# Altium schematic sheet ModulationAnalog.SchDoc
size A3; SheetNumber: 3; SheetTotal: 4
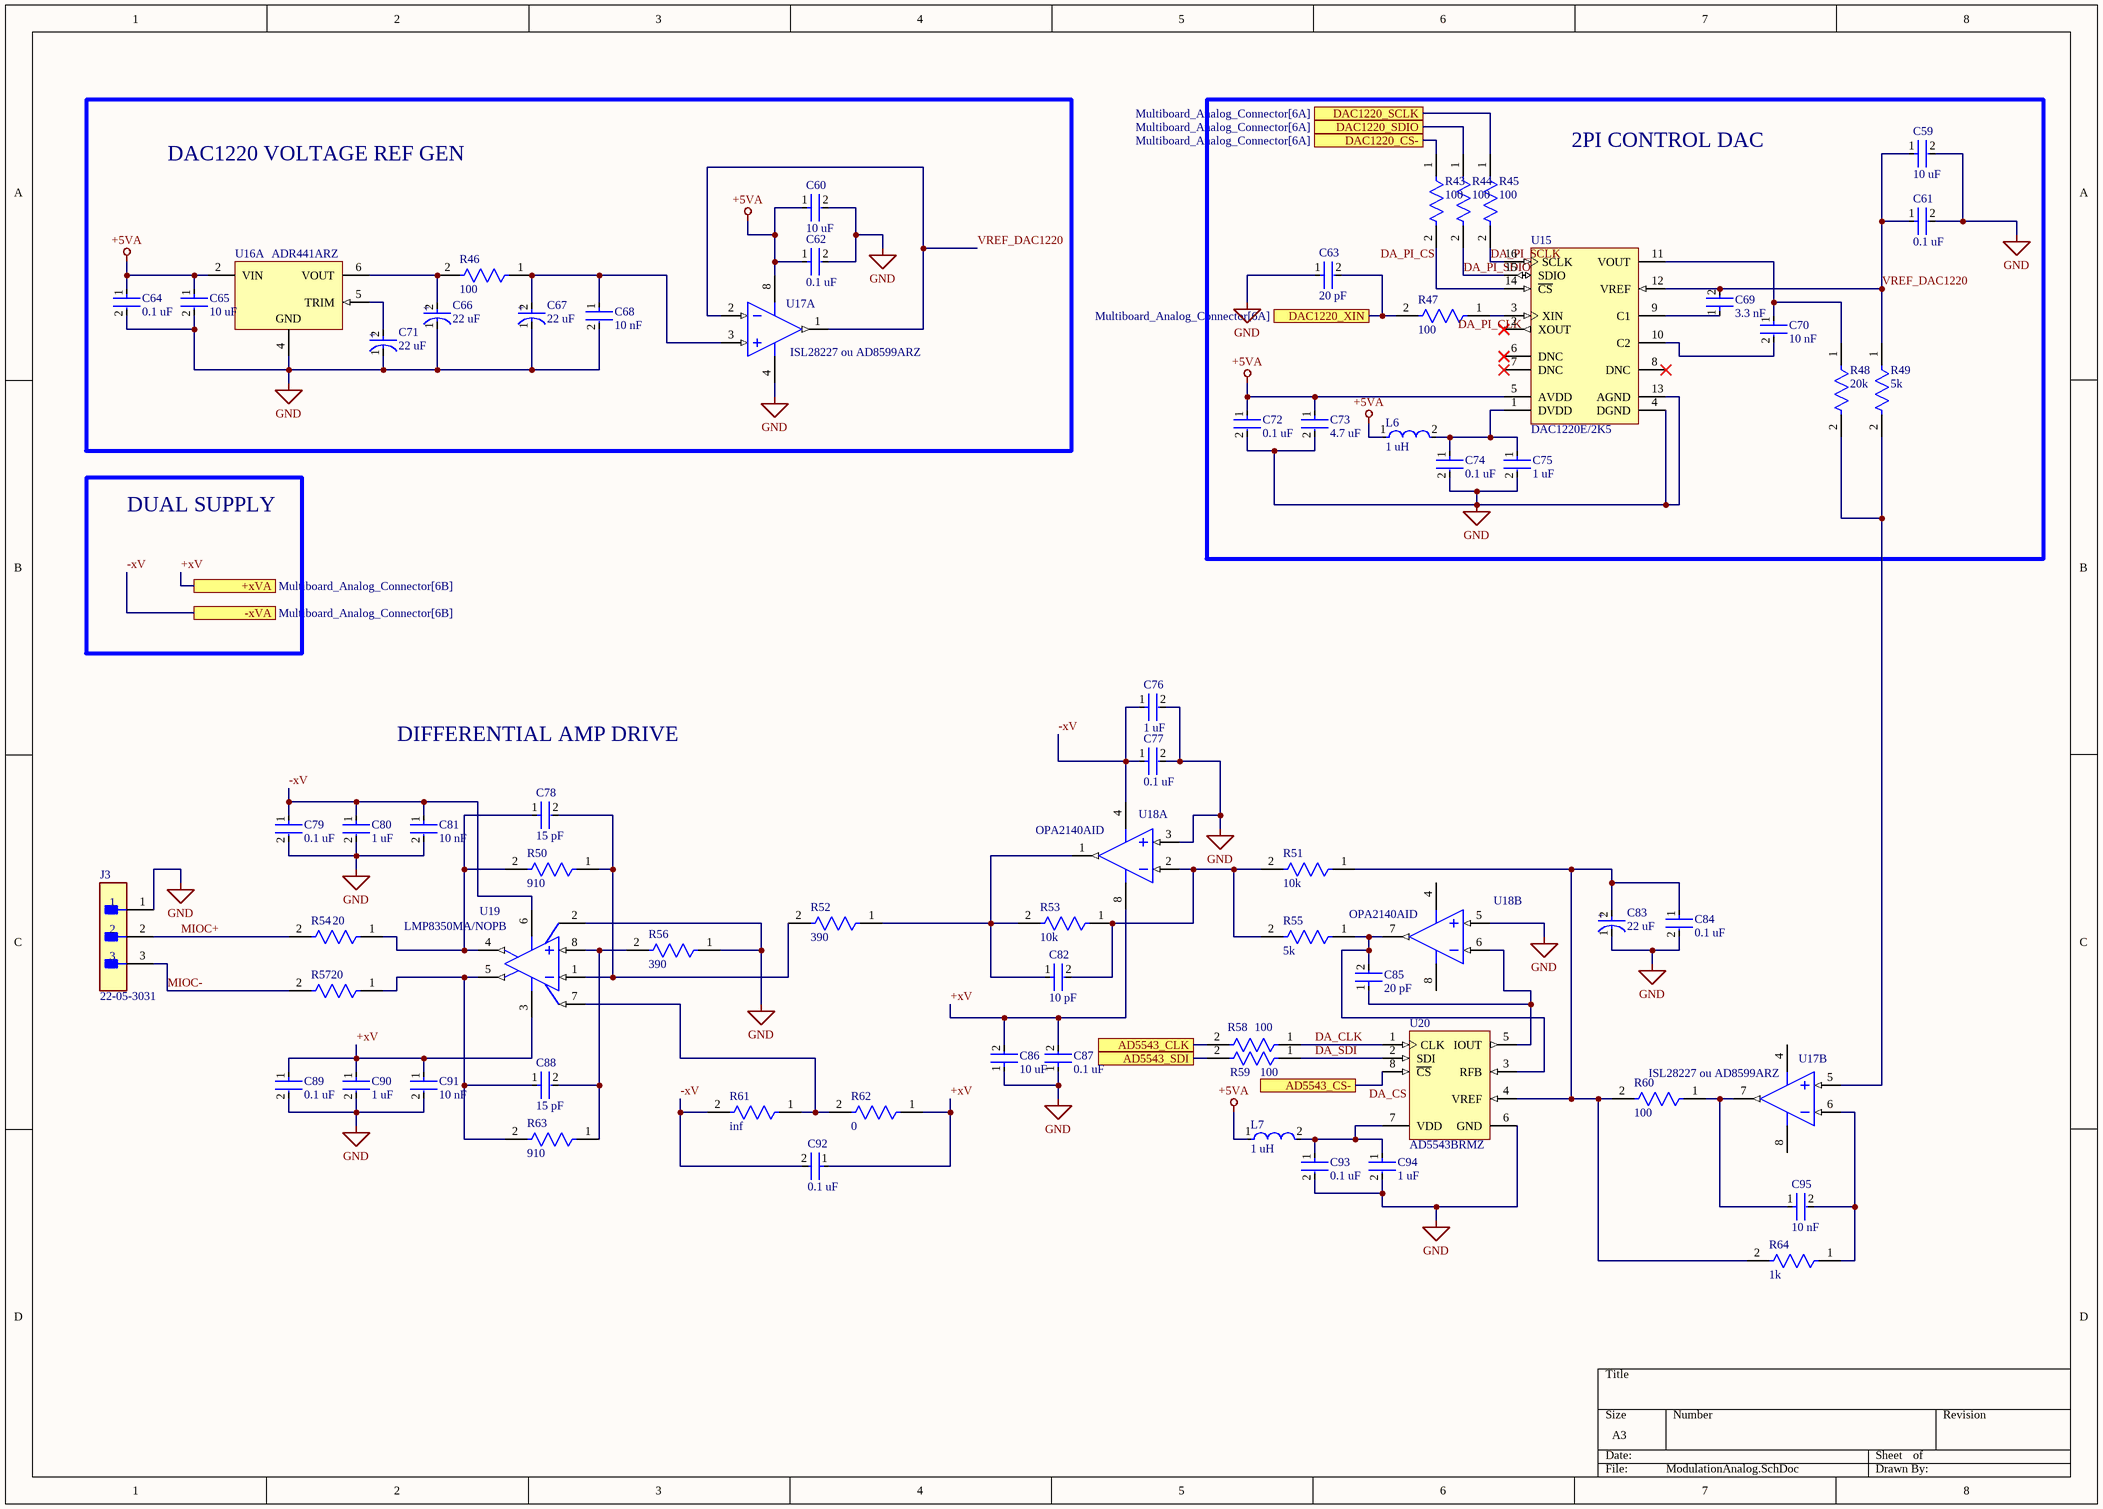
[diagram p0: ModulationAnalog.SchDoc]

## Parts
C59  10 uF  [FP-CC0805-0_85-MFG]
C60  10 uF  [FP-CC0805-0_85-MFG]
C61  0.1 uF  [FP-CC0805-0_85-MFG]
C62  0.1 uF  [FP-CC0805-0_85-MFG]
C63  20 pF  [FP-CC0805-0_85-MFG]
C64  0.1 uF  [FP-CC0805-0_85-MFG]
C65  10 uF  [FP-CC0805-0_85-MFG]
C66  22 uF  [FP-TAJP-MFG]
C67  22 uF  [FP-TAJP-MFG]
C68  10 nF  [FP-CC0805-0_85-MFG]
C69  3.3 nF  [FP-CC0805-0_85-MFG]
C70  10 nF  [FP-CC0805-0_85-MFG]
C71  22 uF  [FP-TAJP-MFG]
C72  0.1 uF  [FP-CC0805-0_85-MFG]
C73  4.7 uF  [FP-CC0805-0_85-MFG]
C74  0.1 uF  [FP-CC0805-0_85-MFG]
C75  1 uF  [FP-CC0805-0_85-MFG]
C76  1 uF  [FP-CC0805-0_85-MFG]
C77  0.1 uF  [FP-CC0805-0_85-MFG]
C78  15 pF  [FP-CC0805-0_85-MFG]
C79  0.1 uF  [FP-CC0805-0_85-MFG]
C80  1 uF  [FP-CC0805-0_85-MFG]
C81  10 nF  [FP-CC0805-0_85-MFG]
C82  10 pF  [FP-CC0805-0_85-MFG]
C83  22 uF  [FP-TAJP-MFG]
C84  0.1 uF  [FP-CC0805-0_85-MFG]
C85  20 pF  [FP-CC0805-0_85-MFG]
C86  10 uF  [FP-CC0805-0_85-MFG]
C87  0.1 uF  [FP-CC0805-0_85-MFG]
C88  15 pF  [FP-CC0805-0_85-MFG]
C89  0.1 uF  [FP-CC0805-0_85-MFG]
C90  1 uF  [FP-CC0805-0_85-MFG]
C91  10 nF  [FP-CC0805-0_85-MFG]
C92  0.1 uF  [FP-CC0805-0_85-MFG]
C93  0.1 uF  [FP-CC0805-0_85-MFG]
C94  1 uF  [FP-CC0805-0_85-MFG]
C95  10 nF  [FP-CC0805-0_85-MFG]
J3  22-05-3031  [FP-22-05-3031-MFG]
L6  1 uH  [FP-LQM21DN_00-IPC_B]
L7  1 uH  [FP-LQM21DN_00-IPC_B]
R43  100  [FP-RR1220-MFG]
R44  100  [FP-RR1220-MFG]
R45  100  [FP-RR1220-MFG]
R46  100  [FP-RR1220-MFG]
R47  100  [FP-RR1220-MFG]
R48  20k  [FP-RR1220-MFG]
R49  5k  [FP-RR1220-MFG]
R50  910  [FP-RR1220-MFG]
R51  10k  [FP-RR1220-MFG]
R52  390  [FP-RR1220-MFG]
R53  10k  [FP-RR1220-MFG]
R54  20  [FP-RR1220-MFG]
R55  5k  [FP-RR1220-MFG]
R56  390  [FP-RR1220-MFG]
R57  20  [FP-RR1220-MFG]
R58  100  [FP-RR1220-MFG]
R59  100  [FP-RR1220-MFG]
R60  100  [FP-RR1220-MFG]
R61  inf  [FP-RR1220-MFG]
R62  0  [FP-RR1220-MFG]
R63  910  [FP-RR1220-MFG]
R64  1k  [FP-RR1220-MFG]
U15  DAC1220E/2K5  [TI-DBQ16_N]
U16  ADR441ARZ  [ADI-R-8_L]  (part A of 2)
U17  ISL28227 ou AD8599ARZ  [ADI-R-8_M]  (parts A,B of 2)
U18  OPA2140AID  [D0008A_N]  (parts A,B of 2)
U19  LMP8350MA/NOPB  [D0008A_L]
U20  AD5543BRMZ  [RM-8_N]

## Blocks framed on the sheet
DAC1220 VOLTAGE REF GEN: C60 C62 C64-C68 C71 R46 U16 U17
2PI CONTROL DAC: C59 C61 C63 C69 C70 C72-C75 L6 R43-R45 R47-R49 U15

## Ports
+xVA (see Multiboard_Analog_Connector[6B]), -xVA (see Multiboard_Analog_Connector[6B]), AD5543_CLK (see Multiboard_Analog_Connector[7A]), AD5543_CS- (see Multiboard_Analog_Connector[7A]), AD5543_SDI (see Multiboard_Analog_Connector[7A]), DAC1220_CS- (see Multiboard_Analog_Connector[6A]), DAC1220_SCLK (see Multiboard_Analog_Connector[6A]), DAC1220_SDIO (see Multiboard_Analog_Connector[6A]), DAC1220_XIN (see Multiboard_Analog_Connector[6A])

## Nets
+5VA: C60.1 C62.1 C64.1 C65.1 C72.1 C73.1 L6.1 L7.1 U15.5(AVDD) U16.2(VIN) U17.8(+V)
GND: C59.2 C60.2 C61.2 C62.2 C63.1 C64.2 C65.2 C66.1(C) C67.1(C) C68.2 C71.1(C) C72.2 C73.2 C74.2 C75.2 C76.2 C77.2 C79.2 C80.2 C81.2 C83.1(C) C84.2 C86.1 C87.1 C89.2 C90.2 C91.2 C93.2 C94.2 J3.1 R56.1 U15.4(DGND) U15.13(AGND) U16.4(GND) U17.4(-V) U18.3(IN_A+) U18.5(IN_B+) U19.2(VOCM) U20.6(GND)
+xV: C86.2 C87.2 C89.1 C90.1 C91.1 C92.1 R62.1 U18.8(V+) U19.3(V+) ; port +xVA
-xV: C76.1 C77.1 C79.1 C80.1 C81.1 C92.2 R61.2 U18.4(V-) U19.6(V-) ; port -xVA
AD5543_CLK: R58.2 ; port AD5543_CLK
AD5543_SDI: R59.2 ; port AD5543_SDI
DA_CLK: R58.1 U20.1(CLK)
DA_CS: U20.8(~{CS}) ; port AD5543_CS-
DA_PI_CLK: R47.1 U15.3(XIN)
DA_PI_CS: R43.2 U15.14(~{CS})
DA_PI_SCLK: R45.2 U15.16(SCLK)
DA_PI_SDIO: R44.2 U15.15(SDIO)
DA_SDI: R59.1 U20.2(SDI)
DAC1220_CS-: R43.1 ; port DAC1220_CS-
DAC1220_SCLK: R45.1 ; port DAC1220_SCLK
DAC1220_SDIO: R44.1 ; port DAC1220_SDIO
DAC1220_XIN: C63.2 R47.2 ; port DAC1220_XIN
MIOC+: J3.2 R54.2
MIOC-: J3.3 R57.2
VREF_DAC1220: C59.1 C61.1 C69.2 R49.1 U15.12(VREF) U17.1(OUT_A) U17.2(-IN_A)
NetC66_2: C66.2(A) R46.2 U16.6(VOUT)
NetC67_2: C67.2(A) C68.1 R46.1 U17.3(+IN_A)
NetC69_1: C69.1 U15.9(C1)
NetC70_1: C70.1 R48.1 U15.11(VOUT)
NetC70_2: C70.2 U15.10(C2)
NetC71_2: C71.2(A) U16.5(TRIM)
NetC74_1: C74.1 C75.1 L6.2 U15.1(DVDD)
NetC78_1: C78.1 R50.2 R54.1 U19.4(OUT+)
NetC78_2: C78.2 R50.1 R52.2 U19.1(IN-)
NetC82_1: C82.1 R52.1 R53.2 U18.1(OUT_A)
NetC82_2: C82.2 R51.2 R53.1 R55.2 U18.2(IN_A-)
NetC83_2: C83.2(A) C84.1 R51.1 R60.2 R64.2 U20.4(VREF)
NetC85_1: C85.1 U18.6(IN_B-) U20.5(IOUT)
NetC85_2: C85.2 R55.1 U18.7(OUT_B) U20.3(RFB)
NetC88_1: C88.1 R57.1 R63.2 U19.5(OUT-)
NetC88_2: C88.2 R56.2 R63.1 U19.8(IN+)
NetC93_1: C93.1 C94.1 L7.2 U20.7(VDD)
NetC95_1: C95.1 R60.1 U17.7(OUT_B)
NetC95_2: C95.2 R64.1 U17.6(-IN_B)
NetR48_2: R48.2 R49.2 U17.5(+IN_B)
NetR61_1: R61.1 R62.2 U19.7(EN)

Not connected (* = marked no-connect by the designer): U15 2(XOUT)* 6(DNC)* 7(DNC)* 8(DNC)*

## Notes on the sheet
- DUAL SUPPLY
- DIFFERENTIAL AMP DRIVE
- (in symbol CMP-2007-04028-2) +

## Library data of the parts
C59-C65 C68-C70 C72-C82 C84-C95 = CMP-1036-04410-2: CAP CER 0.1UF 25V X7R 0805; Manufacturer Part Number: CC0805KRX7R8BB104; Manufacturer: Yageo; Tolerance: 0.1; Material: Ceramic; Value: 100 nF; ComponentLink2URL: http://www.yageo.com/documents/recent/UPY-GPHC_Y5V_6.3V-to-50V_8.pdf; Category: Cap; Mouser Description: Multilayer Ceramic Capacitors MLCC - SMD/SMT 100nF 25V X7R 10%; Device Class L1: Passive Components; Footprint Url: http://www.yageo.com/exep/pages/download/literatures/UPY-C_GEN_24.pdf; Height: 0.95mm; Digikey Description: CAP CER 0.1UF 25V X7R 0805; Lead Free: Yes; Temperature Range High: +85°C; Temperature: -30°C to +85°C; Ipc Land Pattern Name: CAPC200125X85; Capacitance: 100 nF; Automotive: No; Octopart: https://octopart.com/cc0805krx7r8bb104-yageo-39467766; Device Class L2: Capacitors; Temperature Characteristic: X7R; Voltage Rating: 25 V; ComponentLink2Description: Datasheet; Temperature Range Low: -30°C; Device Class L3: Ceramic Capacitors; RoHS: TRUE; Package: CC0805-0.85
C66 C67 C71 C83 = CMP-2007-04028-2: 10uF 10V  ±20% 6Ω 0805  SMD Tantalum Capacitor; Dissipation Factor: 8%; ESR (Equivalent Series Resistance): 6R; Polarity: Polar; Leakage Current: 1uA; Height: 1.5mm; Packaging: Tape and Reel; Max Operating Temperature: 125°C; Lead Free: Lead Free; Length: 2.05mm; RoHS Compliant: Yes; Number of Pins: 2; Case Code (Metric): 2012; Series: TAJ; Height - Seated (Max): 0.059inch; Mount: Surface Mount; REACH SVHC: No SVHC; Depth: 1.35mm; Tolerance: 20%; Case Code (Imperial): 0805; Dielectric Material: Tantalum; Features: General Purpose; Voltage: 10V; Capacitance: 10uF; Package Quantity: 1; Case/Package: 0805; Voltage Rating (DC): 10V; Termination: SMD/SMT; Width: 0.053inch; Min Operating Temperature: -55°C; Voltage Rating: 10V
J3 = CMP-04776-000253-1: CONN HEADER R/A 3POS 2.54MM; Number of Positions: 3; Max Current Rating: 4A; Contact Resistance: 10mR; Voltage Rating (DC): 250V; Gender: Male; Approvals: UL; Insulation Resistance: 50GR; Glow Wire Compliant: Non-compliant; Contact Plating: Tin; Packaging: Bulk; Color: White; Series: 7478; Package Quantity: 2000; Depth: 12.83mm; Mount: Through Hole; Length: 7.62mm; Fastening Type: Friction; Number of Circuits: 3; Lead Pitch: 2.54mm; Housing Color: White; Contact Type: Male Pin; Lead Free: Lead Free; Flammability Rating: UL94 V-0; Halogen Free: Low Halogen; Termination: Solder; Contact Mating Length: 0.264inch; Radiation Hardening: No; Min Operating Temperature: 0°C; Pitch: 2.54mm; RoHS Compliant: Yes; Orientation: Right Angle; Number of Rows: 1; Height: 6.35mm; Max Operating Temperature: 75°C; Voltage Rating: 250V; Contact Material: Brass; Number of Contacts: 3; Housing Material: Nylon; Current Rating: 4A
L6 L7 = CMP-06042-012978-1: Multilayer Type Inductor for General Circuits, 0805 (2012), 1μH, 10%, 0.4Ω, 50mA; Q Factor: 45; Test Frequency: 10MHz; DC Resistance (DCR): 400mR; Core Material: Ferrite; Shielding: Shielded; Inductance: 1uH; Self Resonant Frequency: 107MHz; Mount: Surface Mount; Depth: 1.45mm; Current Rating: 50mA; Lead Free: Lead Free; Height - Seated (Max): 0.041inch; Inductance Tolerance: 10%; Min Operating Temperature: -40°C; Height: 0.85mm; Radiation Hardening: No; Width: 1.25mm; Length: 2mm; Case Code (Imperial): 0805; Termination: SMD/SMT; Package Quantity: 1; Max Operating Temperature: 85°C; Case Code (Metric): 2012; Case/Package: 0805; Max DC Current: 50mA; DC Current: 50mA; Military Standard: Not; REACH SVHC: No SVHC; Packaging: Tape and Reel; Tolerance: 10%
R43-R64 = CMP-2001-03560-2: 49.9Ω ±0.5% 0.1W 1/10W Chip Resistor 0805 (2012 Metric) Thin Film; Voltage Rating: 100V; Temperature Coefficient: 50ppm/°C; Max Power Dissipation: 100mW; Resistance: 49.9R; Packaging: Tape and Reel; Length: 0.079inch; Termination: SMD/SMT; Case Code (Metric): 2012; Voltage Rating (DC): 100V; Height: 0.02inch; Width: 0.049inch; RoHS Compliant: Yes; Tolerance: 0.5%; Case/Package: 0805; Resistance Tolerance: 0.5%; Lead Free: Lead Free; Size Code: 0805; Min Operating Temperature: -55°C; Max Operating Temperature: 125°C; Case Code (Imperial): 0805; Package Quantity: 1; Resistor Type: Thin Film; Number of Terminations: 2; Power Rating: 100mW; Series: RR
U15 = CMP-0004-00314-1: 20-Bit Delta-Sigma Low Power DAC, -40 to 85 degC, 16-pin SOP (DBQ16), Green (RoHS & no Sb/Br); Manufacturer: Texas Instruments; SubFamily: Precision DAC (=<10MSPS); Settling Time(us): 2000; DAC Channels: 1; Interface: Serial SPI; Resolution(Bits): 20; Power Consumption(Typ)(mW): 2.5; PackageDescription: 16-Pin Plastic Small Outline, Body 3.9 x 4.9 mm, Pitch 0.635 mm; PartNumber: DAC1220E/2K5; ComponentLink3Description: Package Specification; Mounting Technology: Surface Mount; ComponentLink2Description: Datasheet; Code_JEDEC: MO-137; DNL(Max)(+/-LSB): 1; PackageVersion: 4073301-2/H, 10/2008; PackageReference: DBQ16; Eco-Plan: Green (RoHS & no Sb/Br); ComponentLink2URL: http://www.ti.com/general/docs/lit/getliterature.tsp?genericPartNumber=DAC1220&fileType=pdf; DatasheetVersion: SBAS082G; INL(Max)(+/-LSB): 1; ComponentLink1URL: http://www.ti.com/; ComponentLink1Description: Manufacturer URL; ComponentLink3URL: http://www.ti.com/litv/pdf/msoi004g
U16 = CMP-0784-00172-1: Ultralow Noise, LDO XFET Voltage Reference with Current Sink and Source, 2.5 V Output, 3 to 18 V Supply, Industrial, 8-pin SOIC (R-8), Tube; Manufacturer: Analog Devices; Vout: 2.5V; Ref Out TC (ppm/C): 2; Min V Supply (V): 3; Max V Supply (V): 18; Packing: Tube; ComponentLink2URL: http://www.analog.com/static/imported-files/data_sheets/ADR440_441_443_444_445.pdf; PackageVersion: 060506-A, 06/2006; PartNumber: ADR441ARZ; PackageDescription: 8-Pin Standard Small Outline Package, Body 4.9 x 3.9 mm, Pitch 1.27 mm; PackageReference: R-8; ComponentLink2Description: Datasheet; ComponentLink3URL: http://www.analog.com/static/imported-files/packages/PKG_PDF/SOIC_Narrow%20(R)/R_8.pdf; Operating Temp Range: -40 to 125 degC; ComponentLink3Description: Package Specification; ComponentLink1Description: Manufacturer URL; Code_JEDEC: MS-012-AA; ComponentLink1URL: http://www.analog.com/en/index.html; DatasheetVersion: Rev. E; ComponentLink4URL: Product URL:http://www.analog.com/en/special-linear-functions/voltage-references/adr441/products/product.html; Mounting Technology: Surface Mount; ComponentLink4Description: URL Link1
U17 = CMP-0384-01156-2: Double Channel Wide Bandwidth Operational Amplifier, 10 MHz BW, 16 V/us SR, Industrial, 8-pin SOIC (R-8), Tube; Manufacturer: Analog Devices; Generic Part Number: AD8599; Slew Rate: 14V/us; V Span Min: 9V; Amplifiers Per Package: 2; Input Offset Voltage: 10uV; Input Bias Current: 25nA; Iq/Amp: 5.7mA; V Span Max: 30V; Small Signal Bandwidth: 10MHz; PackageDescription: 8-Pin Standard Small Outline Package, Body 3.9 x 4.9 mm, Pitch 1.27 mm; ComponentLink3URL: http://www.analog.com/static/imported-files/packages/PKG_PDF/SOIC_Narrow%20(R)/R_8.pdf; ComponentLink2Description: Datasheet; RevisionNote: Reference Circuit URL fixed; ComponentLink3Description: Package Specification; Code_JEDEC: MS-012-AA; DatasheetVersion: Rev. C; ComponentLink4URL: http://www.analog.com/en/all-operational-amplifiers-op-amps/operational-amplifiers-op-amps/ad8599/products/product.html#product-recommendations; PartNumber: AD8599ARZ; Mounting Technology: Surface Mount; ComponentLink4Description: Reference Circuit; ComponentLink1Description: Manufacturer URL; PackageReference: R-8; ComponentLink1URL: http://www.analog.com/en/index.html; PackageVersion: 060506-A; ComponentLink2URL: http://www.analog.com/static/imported-files/data_sheets/AD8597_8599.pdf
U18 = CMP-0272-00255-3: 11 MHz, Precision, Low Noise, Rail-to-Rail Output, JFET Operational Amplifier, 4.5 to 36 V, -40 to 125 degC, 8-pin SOIC (D8), Green (RoHS & no Sb/Br); Manufacturer: Texas Instruments; CMRR(Min)(dB): 126; Packing: TUBE; Offset Drift(Typ)(uV/C): 0.35; Total Supply Voltage(Min)(+5V is 5, +/-5V is 10): 4.5; Total Supply Voltage(Max)(+5V is 5, +/-5V is 10): 36; Rating: Catalog; Iq per channel(Max)(mA): 2; Slew Rate(Typ)(V/us): 20; Vio (25C)(Max)(mV): 0.12; GBW(Typ)(MHz): 11; Sub Family: High Supply Voltage Amplifier (>=30V), Low Input Bias Current Amp (<=10pA), Low Noise Amp (<=10nV/rtHz), Low Offset Voltage Amplifier (<=500uV), Precision Amplifier; IIB(Max)(pA): 10; ComponentLink3Description: Package Specification; DatasheetVersion: SBOS498A; ComponentLink1Description: Manufacturer URL; Eco-Plan: Green (RoHS & no Sb/Br); ComponentLink1URL: http://www.ti.com/; PartNumber: OPA2140AID; Code_JEDEC: MS-012; Number of Channels: 2; ComponentLink2URL: http://www.ti.com/lit/ds/symlink/opa2140.pdf; PackageDescription: 8-Pin Plastic Small Outline, Body 4.9 x 3.9 mm, Pitch 1.27 mm; Mounting Technology: Surface Mount; PackageReference: D0008A; ComponentLink2Description: Datasheet; PackageVersion: 4040047-3/M, 06/2011; ComponentLink3URL: http://www.ti.com/litv/pdf/msoi002j
U19 = CMP-0055-01616-2: Ultra Low Distortion Fully Differential Precision ADC Driver with Selectable Power Modes, 8-pin Narrow SOIC, 95 Rail; Manufacturer: Texas Instruments; PackageTopMarking: NSZXTT*LMP83*50MA; PowerWise: Y; CompType: Amplifiers; PinCount: 8; Code_IPC: SOIC127P600-8; RoHS: Y; ComponentLink1Description: Datasheet URL; Package Reference: D0008A; Code_JEDEC: MS-012-AA; PackageDescription: SOIC Narrow, 4.9 x 3.9 x 1.45mm, 8 Lead, 1.27mm Pitch; ComponentLink1URL: http://www.ti.com/general/docs/lit/getliterature.tsp?genericPartNumber=LMP8350&fileType=pdf
U20 = CMP-0318-01915-2: Single 16-Bit Current Output Digital-to-Analog Converter with Serial Interface, -40 to +85 degC, RM-8, Pb-Free, Tube; Generic Part Number: AD5543; Manufacturer: Analog Devices; Op Pwr Diss: 55ÂµW; Settling Time: 500ns; Max V+: 5.5V; Resolution (Bits): 16; # DAC Outputs: 1; Single Supply: Yes; Code_JEDEC: MO-187-AA; ComponentLink5URL: http://www.analog.com/en/digital-to-analog-converters/da-converters/ad5543/products/product.html#prod_cross_sell; DatasheetVersion: Rev.F; ComponentLink3Description: Package Specification; RoHS: Y; PartNumber: AD5543BRMZ; ComponentLink2Description: Datasheet; ComponentLink3URL: http://www.analog.com/static/imported-files/packages/PKG_PDF/MSOP%28RM%29/RM_8.pdf; PackageVersion: Aug-2005; ComponentLink4URL: http://www.analog.com/en/digital-to-analog-converters/da-converters/ad5543/products/product.html; PackageReference: RM-8; Mounting Technology: Surface Mount; PackageDescription: 8-Lead Mini Small Outline Package [MSOP]; RevisionNote: Component URL fixed; ComponentLink5Description: Reference Design URL; ComponentLink2URL: http://www.analog.com/static/imported-files/data_sheets/AD5543_5553.pdf; ComponentLink1URL: http://www.analog.com/en/index.html; Packing: Tube; ComponentLink1Description: Manufacturer URL; ComponentLink4Description: Product URL